# Altium schematic sheet MEASUREMENT.SchDoc
size A3; SheetNumber: 6; SheetTotal: 6
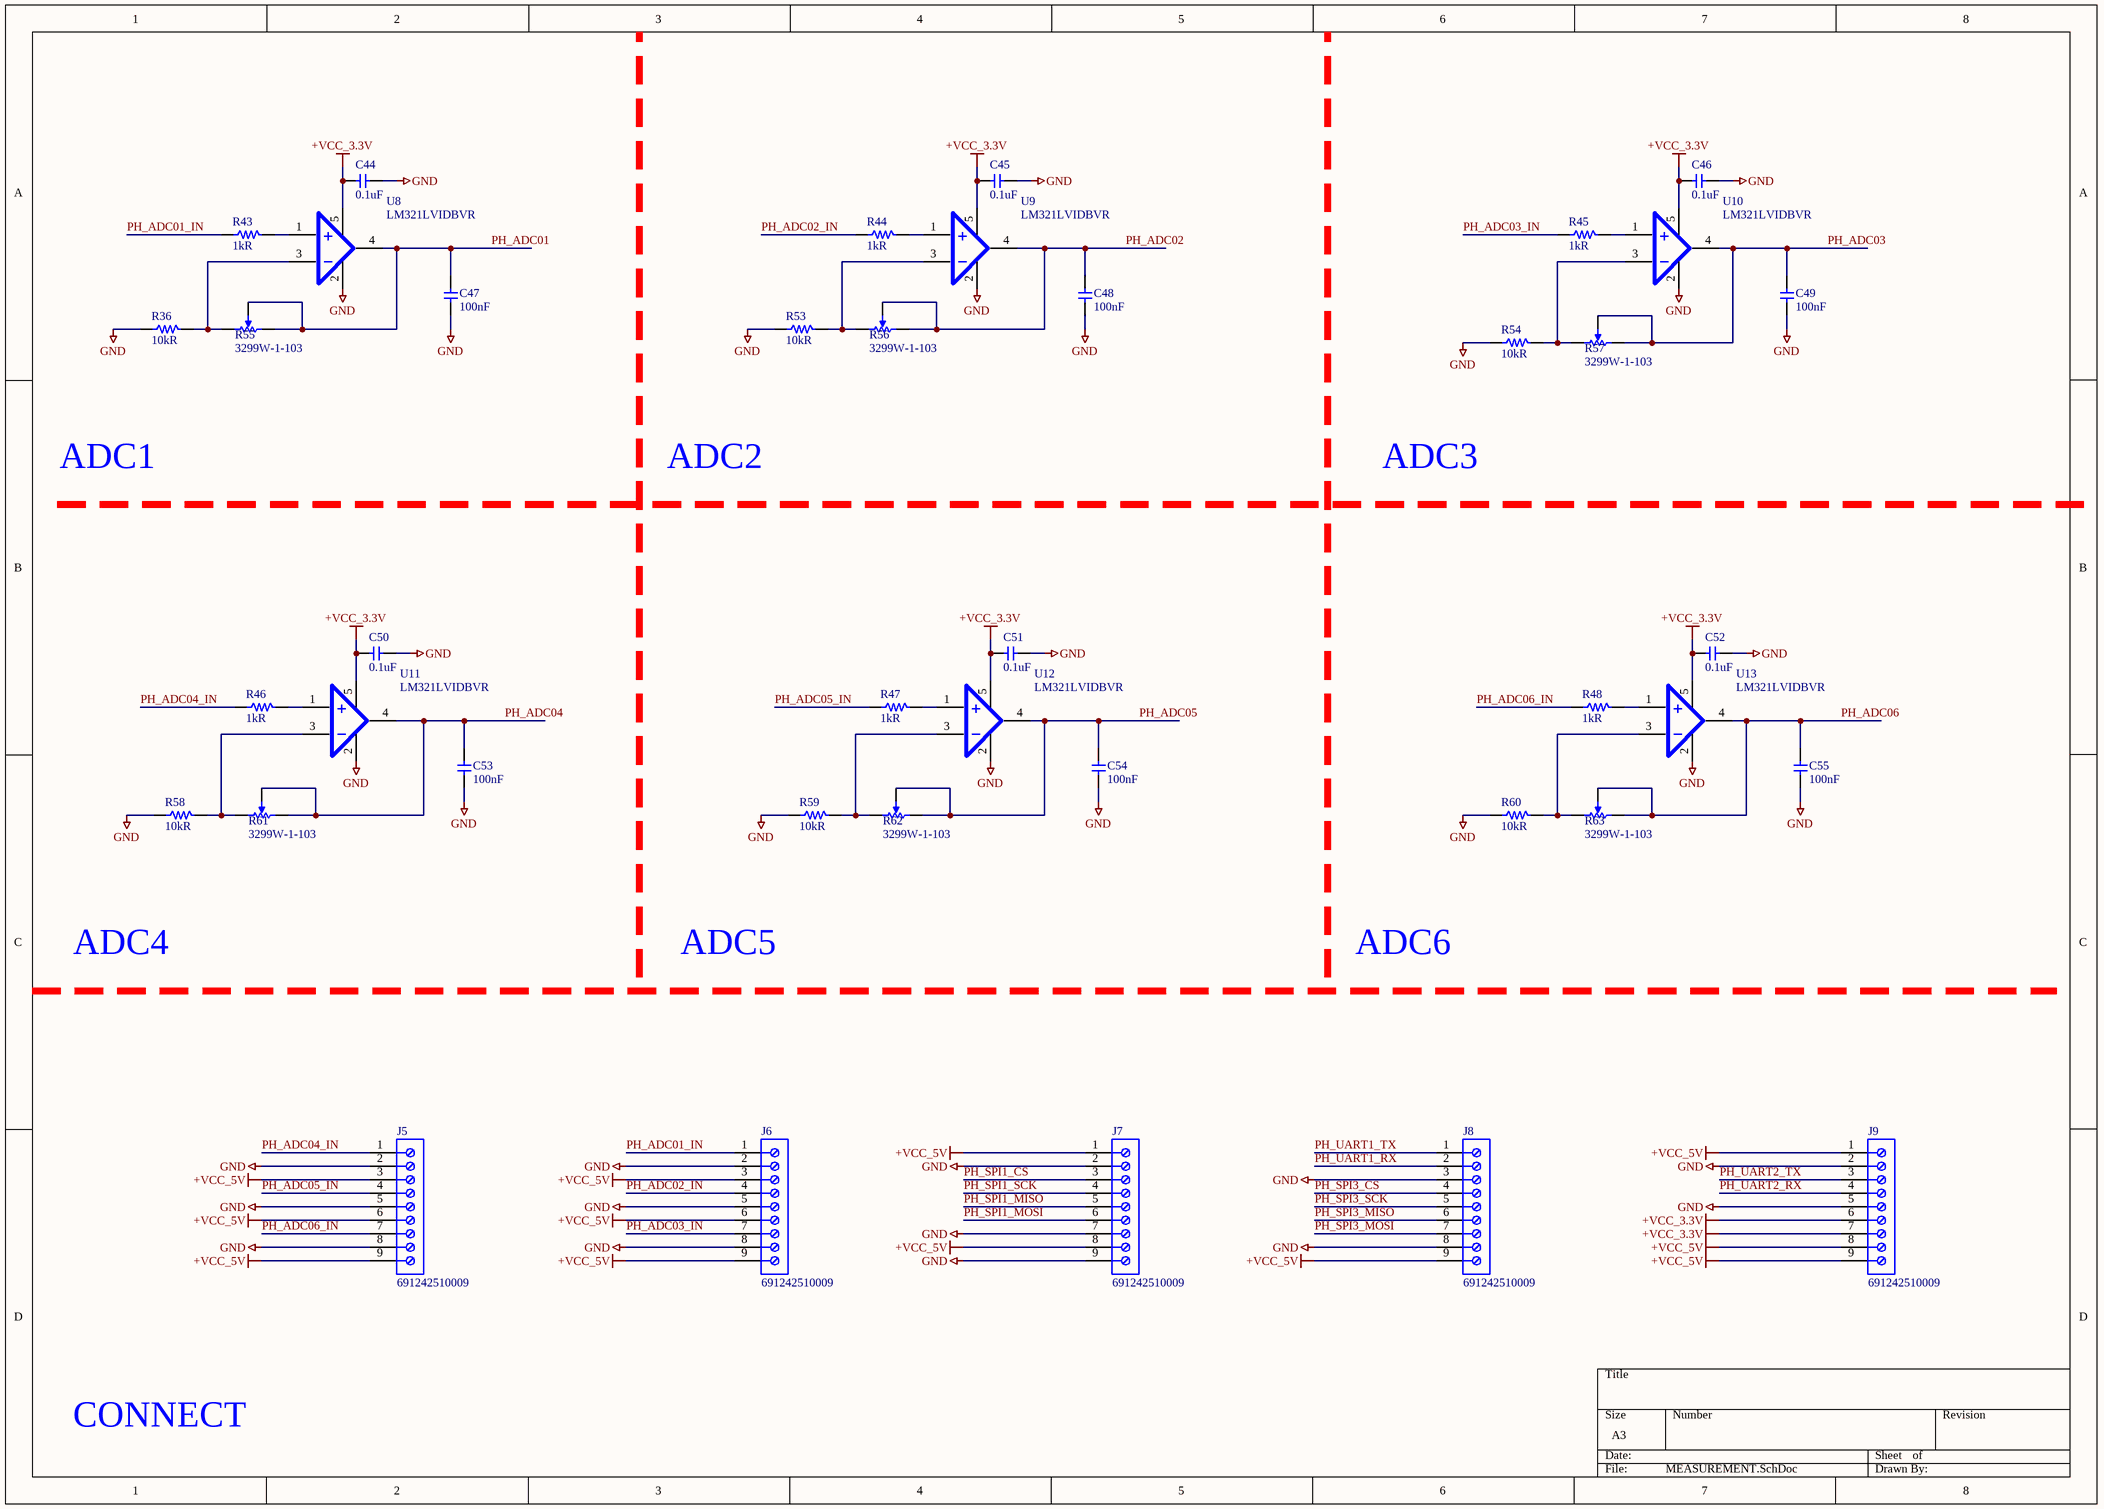
[diagram p0: MEASUREMENT.SchDoc]

## Parts
C44  0.1uF  [CAP 0402 (1005)]
C45  0.1uF  [CAP 0402 (1005)]
C46  0.1uF  [CAP 0402 (1005)]
C47  100nF  [CAP 0402 (1005)]
C48  100nF  [CAP 0402 (1005)]
C49  100nF  [CAP 0402 (1005)]
C50  0.1uF  [CAP 0402 (1005)]
C51  0.1uF  [CAP 0402 (1005)]
C52  0.1uF  [CAP 0402 (1005)]
C53  100nF  [CAP 0402 (1005)]
C54  100nF  [CAP 0402 (1005)]
C55  100nF  [CAP 0402 (1005)]
J5  691242510009  [691242510009]
J6  691242510009  [691242510009]
J7  691242510009  [691242510009]
J8  691242510009  [691242510009]
J9  691242510009  [691242510009]
R36  10kR  [RES 0402 (1005)]
R43  1kR  [RES 0402 (1005)]
R44  1kR  [RES 0402 (1005)]
R45  1kR  [RES 0402 (1005)]
R46  1kR  [RES 0402 (1005)]
R47  1kR  [RES 0402 (1005)]
R48  1kR  [RES 0402 (1005)]
R53  10kR  [RES 0402 (1005)]
R54  10kR  [RES 0402 (1005)]
R55  3299W-1-103  [BOUR-3299W-3_V]
R56  3299W-1-103  [BOUR-3299W-3_V]
R57  3299W-1-103  [BOUR-3299W-3_V]
R58  10kR  [RES 0402 (1005)]
R59  10kR  [RES 0402 (1005)]
R60  10kR  [RES 0402 (1005)]
R61  3299W-1-103  [BOUR-3299W-3_V]
R62  3299W-1-103  [BOUR-3299W-3_V]
R63  3299W-1-103  [BOUR-3299W-3_V]
U8  LM321LVIDBVR  [SOT-23-5]
U9  LM321LVIDBVR  [SOT-23-5]
U10  LM321LVIDBVR  [SOT-23-5]
U11  LM321LVIDBVR  [SOT-23-5]
U12  LM321LVIDBVR  [SOT-23-5]
U13  LM321LVIDBVR  [SOT-23-5]

## Nets
+VCC_3.3V: C44.2 C45.2 C46.2 C50.2 C51.2 C52.2 J9.6 J9.7 U8.5 U9.5 U10.5 U11.5 U12.5 U13.5
+VCC_5V: J5.3 J5.6 J5.9 J6.3 J6.6 J6.9 J7.1 J7.8 J8.9 J9.1 J9.8 J9.9
GND: C44.1 C45.1 C46.1 C47.1 C48.1 C49.1 C50.1 C51.1 C52.1 C53.1 C54.1 C55.1 J5.2 J5.5 J5.8 J6.2 J6.5 J6.8 J7.2 J7.7 J7.9 J8.3 J8.8 J9.2 J9.5 R36.2 R53.2 R54.2 R58.2 R59.2 R60.2 U8.2 U9.2 U10.2 U11.2 U12.2 U13.2
PH_ADC01: C47.2 R55.1 R55.2 U8.4
PH_ADC01_IN: J6.1 R43.2
PH_ADC02: C48.2 R56.1 R56.2 U9.4
PH_ADC02_IN: J6.4 R44.2
PH_ADC03: C49.2 R57.1 R57.2 U10.4
PH_ADC03_IN: J6.7 R45.2
PH_ADC04: C53.2 R61.1 R61.2 U11.4
PH_ADC04_IN: J5.1 R46.2
PH_ADC05: C54.2 R62.1 R62.2 U12.4
PH_ADC05_IN: J5.4 R47.2
PH_ADC06: C55.2 R63.1 R63.2 U13.4
PH_ADC06_IN: J5.7 R48.2
PH_SPI1_CS: J7.3
PH_SPI1_MISO: J7.5
PH_SPI1_MOSI: J7.6
PH_SPI1_SCK: J7.4
PH_SPI3_CS: J8.4
PH_SPI3_MISO: J8.6
PH_SPI3_MOSI: J8.7
PH_SPI3_SCK: J8.5
PH_UART1_RX: J8.2
PH_UART1_TX: J8.1
PH_UART2_RX: J9.4
PH_UART2_TX: J9.3
NetR36_1: R36.1 R55.3 U8.3
NetR43_1: R43.1 U8.1
NetR44_1: R44.1 U9.1
NetR45_1: R45.1 U10.1
NetR46_1: R46.1 U11.1
NetR47_1: R47.1 U12.1
NetR48_1: R48.1 U13.1
NetR53_1: R53.1 R56.3 U9.3
NetR54_1: R54.1 R57.3 U10.3
NetR58_1: R58.1 R61.3 U11.3
NetR59_1: R59.1 R62.3 U12.3
NetR60_1: R60.1 R63.3 U13.3

## Notes on the sheet
- ADC1
- ADC2
- ADC3
- ADC4
- ADC5
- ADC6
- CONNECT

## Library data of the parts
C44-C55 = CAP0402 0.1uF 50V: 50V 100nF ±10% 0402 Multilayer Ceramic Capacitors MLCC - SMD/SMT ROHS; Manufacturer: Samwha Capacitor; Manufacturer Part Number: CS1005X7R104K500NR; Supplier: LCSC electronics; Unit Price: $0.0017
J5-J9 = CMP-1502-02641-3: Terminal Block, 5.08MM Pitch, Horizontal, Rising Cage Clamp, 12-30 AWG, 9 Pin
R36 R43-R48 R53 R54 R58-R60 = RES0402 10kR 1%: ±1% 10kΩ 0402 Chip Resistor - Surface Mount ROHS; Manufacturer: VO; Manufacturer Part Number: SCR0402F10K; Supplier: LCSC electronics; Unit Price: $0.0005
R55-R57 R61-R63 = CMP-2000-05584-1: Square Trimpot(R) Trimming Potentiometer, 10 KOhm, +/- 10%, 500 mW, -55 to 125 degC, 3-Pin THD, RoHS, Tube; Element Type: Cermet; Unit Weight: 0.035000oz; Brand: Bourns; Power Rating: 500mW(1/2W); Resistance: 10kOhms; Qualification: Commercial; Adjustment: TopCrossed; Datasheet Version: 04/2014; Product Category: TrimmerResistors-ThroughHole; Mounting Technology: ThroughHole; Manufacturer URL: http://www.bourns.com/; Package Description: 3-Pin Surface Mount Device, Body 9.53 x 6.1 mm, Pitch 2.54 mm; Product: Multiturn; Length: 10.03mm; Termination Style: Pin; Tradename: Trimpot; Type: Trimmers; Manufacturer: Bourns; Width: 9.53mm; Mounting: PanelMount; RoHS: No / RoHSVersionAvailable; Taper: Linear; Datasheet URL: http://www.bourns.com/docs/Product-Datasheets/3299.pdf; Product Type: SquareTrimmingPotentiometer; Package Reference: 3299W; Tolerance: 10%; Series: 3299; Operating Temperature Range: -55Cto+125C; Packaging: Tube
U8-U13 = IC OPAM LM321LVIDBVR: IC OPAMP GP 1 CIRCUIT SOT23-5; Manufacturer: Texas Instruments; Alternative MPN: LK_13449; Supplier 1: Digi-Key; Manufacturer Part Number: LM321LVIDBVR; Stock 1: 22892; Pricing 1: 1=0.4, 10=0.304, 25=0.274, 100=0.1894, 250=0.1594, 500=0.1296, 1000=0.0997 (USD); ComponentLink1URL: http://www.ti.com/general/docs/suppproductinfo.tsp?distId=10&amp;gotoUrl=http%3A%2F%2Fwww.ti.com%2Flit%2Fgpn%2Flm321lv&src-supplier=Digi-Key; ComponentLink1Description: http://www.ti.com/general/docs/suppproductinfo.tsp?distId=10&amp;gotoUrl=http%3A%2F%2Fwww.ti.com%2Flit%2Fgpn%2Flm321lv&src-supplier=Digi-Key; Supplier Part Number 1: 296-51261-1-ND